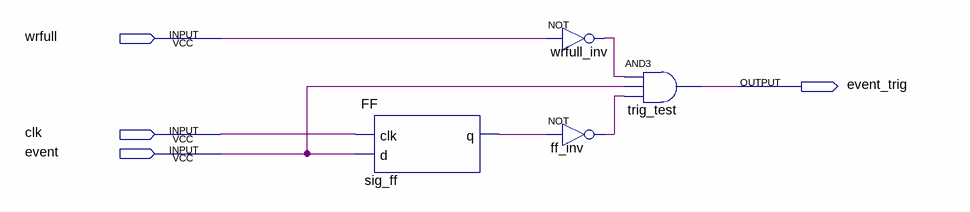
[diagram p0: schematic sheet]
// Quartus schematic edge_trigger.bdf as structural Verilog: 4 symbols, 4 pins
module edge_trigger (
  input  wrfull,
  input  clk,
  input  \event ,
  output event_trig
);

  wire ff_inv_out, sig_ff_q, wrfull_inv_out;

  FF sig_ff (.clk(clk), .d(\event ), .q(sig_ff_q));
  not wrfull_inv (wrfull_inv_out, wrfull);
  not ff_inv (ff_inv_out, sig_ff_q);
  and trig_test (event_trig, wrfull_inv_out, \event , ff_inv_out);
endmodule
